# EasyEDA schematic SCH_ch559_2022-01-07.json
TITLE: CH559L 最小系统板; REV: 1.0; Date: 2021-06-14; Sheet: 1/1; Drawn By: DT9025A; Company: DT9025A
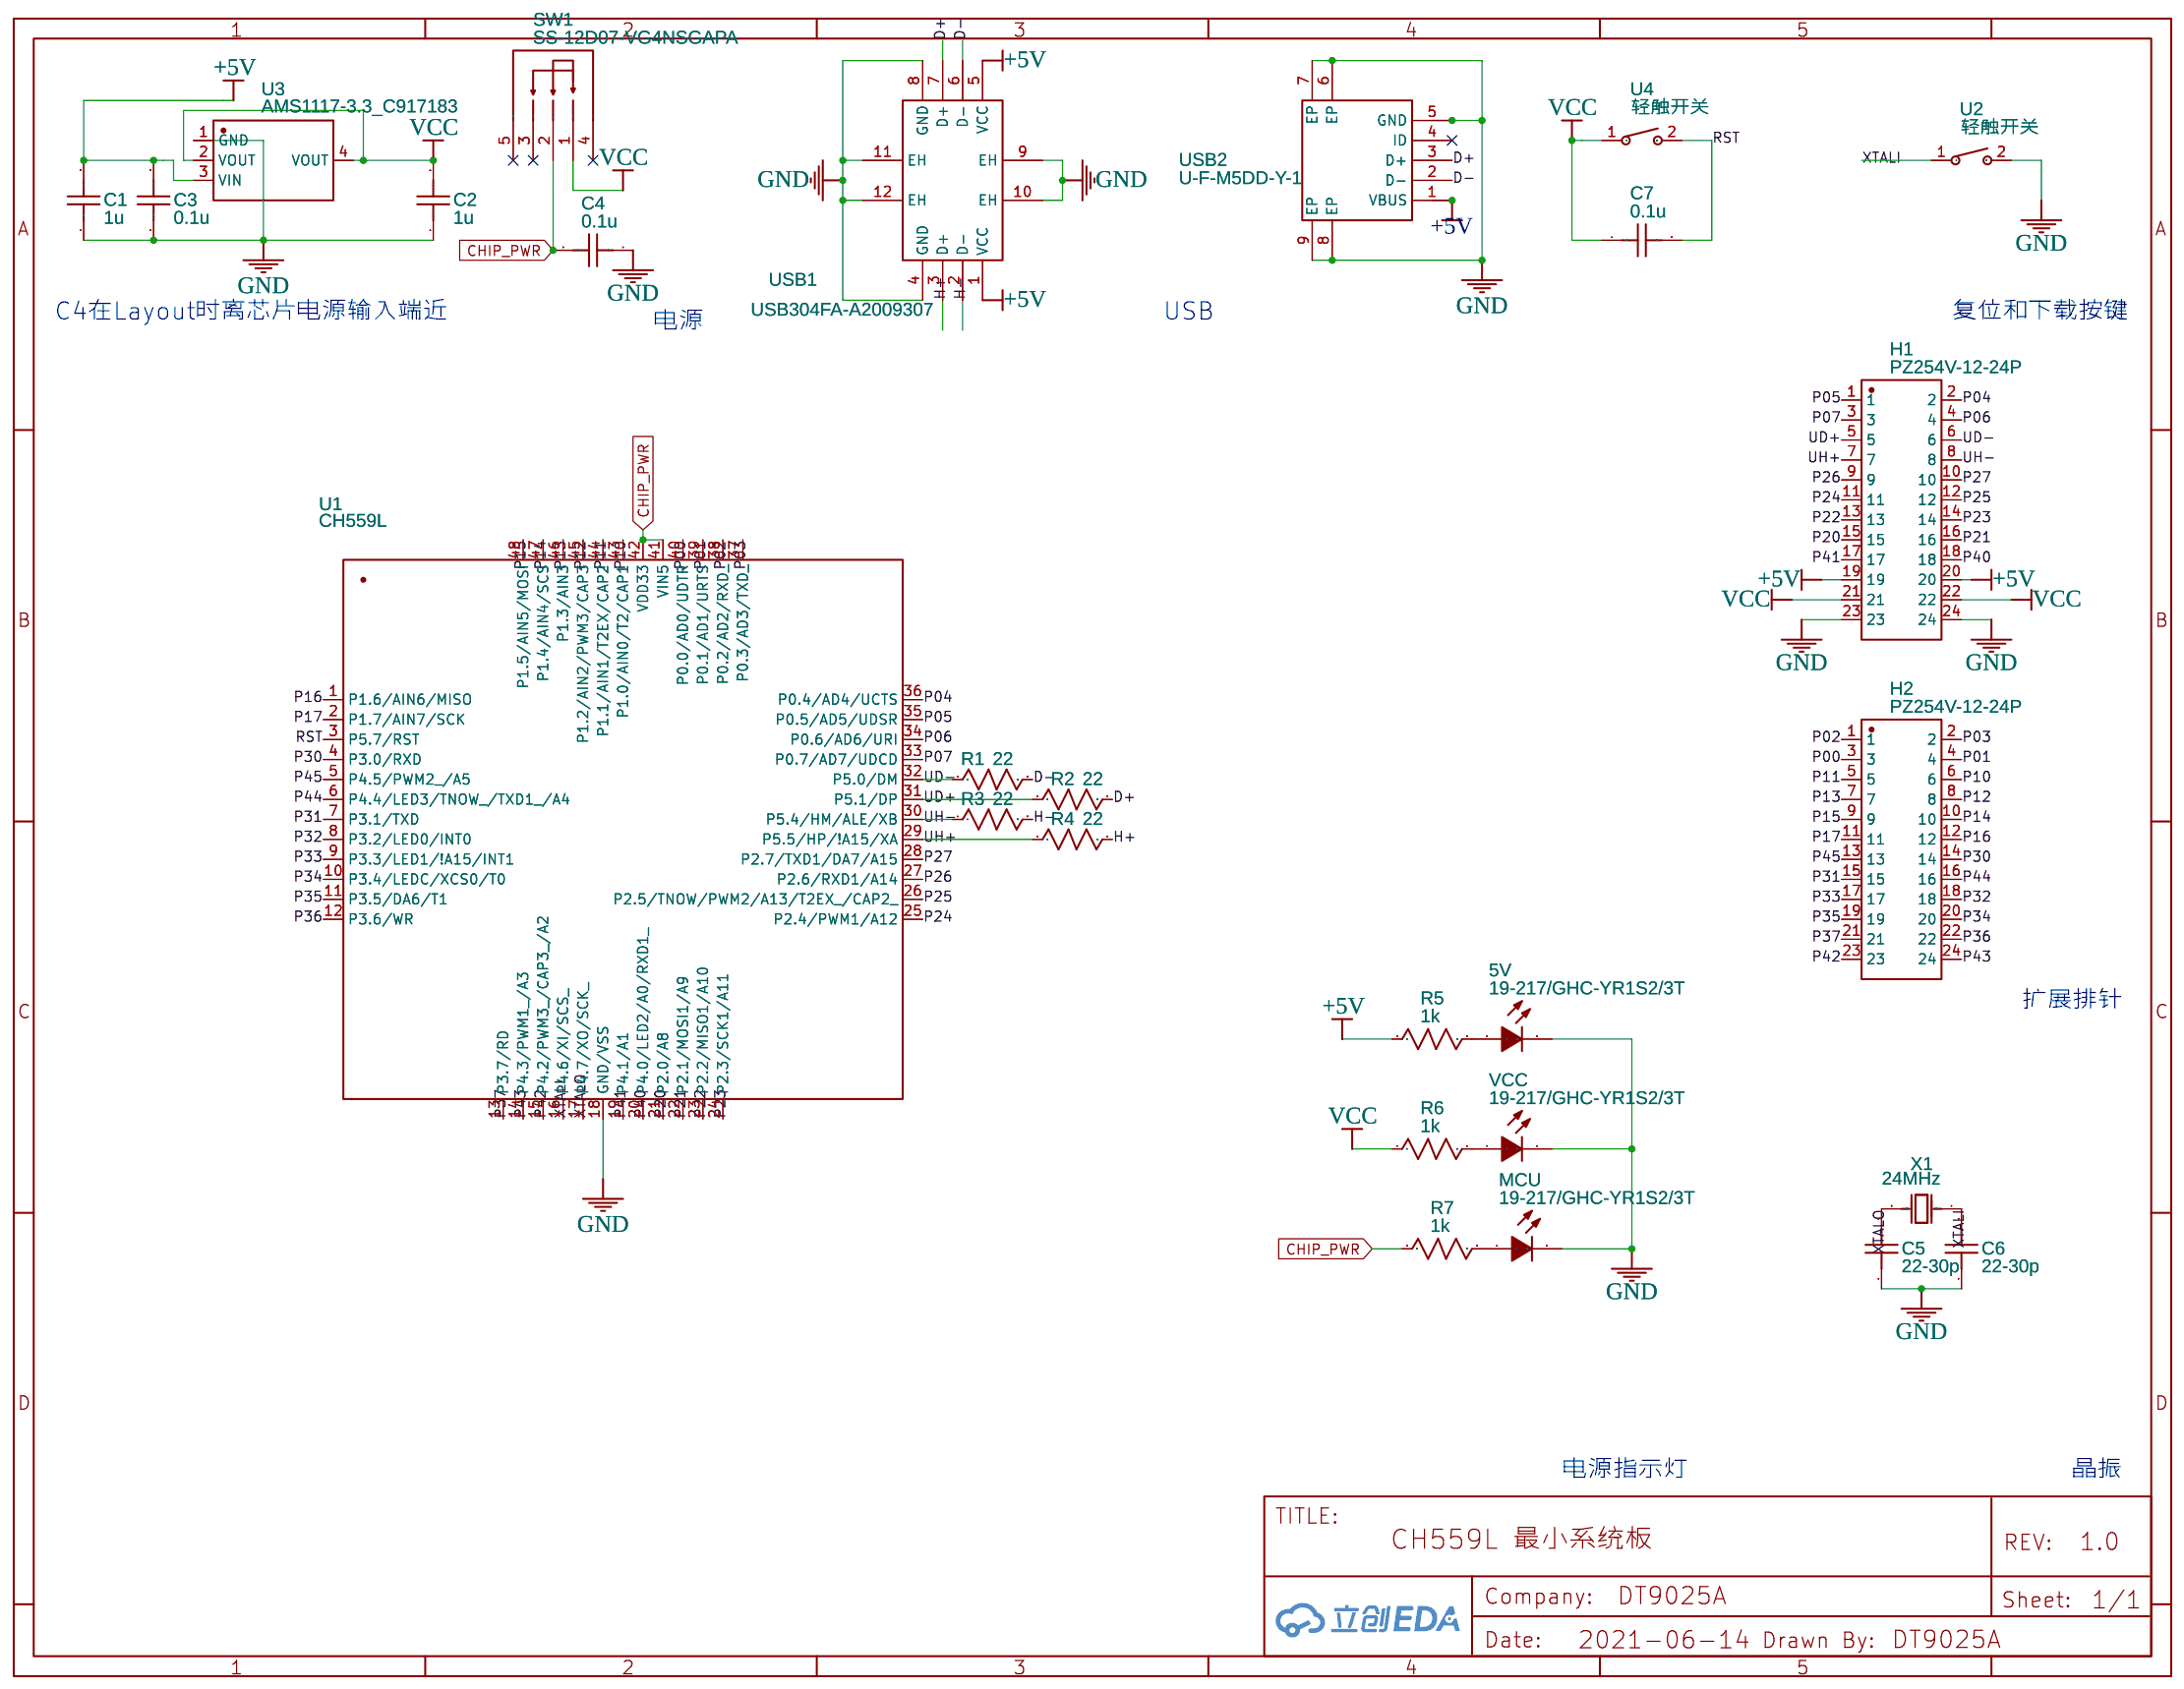
[diagram p0: schematic sheet]

## Parts
5V  19-217/GHC-YR1S2/3T  [LED0603-R-RD]
C1  1u  [C0603]
C2  1u  [C0603]
C3  0.1u  [C0603]
C4  0.1u  [C0603]
C5  22-30p  [C0603]
C6  22-30p  [C0603]
C7  0.1u  [C0603]
H1  PZ254V-12-24P  [HDR-TH_24P-P2.54-V-M-R2-C12-S2.54]
H2  PZ254V-12-24P  [HDR-TH_24P-P2.54-V-M-R2-C12-S2.54]
MCU  19-217/GHC-YR1S2/3T  [LED0603-R-RD]
R1  22  [R0603]
R2  22  [R0603]
R3  22  [R0603]
R4  22  [R0603]
R5  1k  [R0603]
R6  1k  [R0603]
R7  1k  [R0603]
SW1  SS-12D07-VG4NSGAPA  [SW-TH_SS-12D07-VG4NSGAPA]
U1  CH559L  [LQFP-48_7X7X05P]
U2  轻触开关  [SW-SMD_L6.0-W3.6-LS7.8]
U3  AMS1117-3.3_C917183  [SOT-223-3_L6.7-W3.7-P2.30-LS7.0-BR]
U4  轻触开关  [SW-SMD_L6.0-W3.6-LS7.8]
USB1  USB304FA-A2009307  [USB-A-TH_USB304FA-A2009307]
USB2  U-F-M5DD-Y-1  [MICRO-USB-SMD_U-F-M5DD-Y-1]
VCC  19-217/GHC-YR1S2/3T  [LED0603-R-RD]
X1  24MHz  [HC-49US_L11.5-W4.5-P4.88]

## Library data of the parts
5V MCU VCC = 19-217/GHC-YR1S2/3T: Supplier: LCSC; Manufacturer: EVERLIGHT; Supplier Part: C72043; JLCPCB Part Class: Basic Part
C1 C2 = C_0603_US: Contributor: LCEDA_Lib
C3-C7 = C_0805_US: Contributor: LCEDA_Lib
H1 H2 = PZ254V-12-24P: Supplier: LCSC; Supplier Part: C492429; Manufacturer: XFCN; Contributor: LCSC; JLCPCB Part Class: Extended Part
R1-R7 = R_0603_US: Contributor: LCEDA_Lib
SW1 = SS-12D07-VG4NSGAPA: Supplier: LCSC; Supplier Part: C221975; Manufacturer: C&K; Contributor: LCSC; JLCPCB Part Class: Extended Part
U1 = CH559L: Supplier: LCSC; Supplier Part: C150548; Manufacturer: Jiangsu Qin Heng; Contributor: liangcha; LCSC Assembly: Yes; SMT Type: Extend
U2 U4 = 轻触开关: Supplier: LCSC; Supplier Part: C9900000012; Manufacturer: null; JLCPCB Part Class: Extended Part; Contributor: LCSC
U3 = AMS1117-3.3_C917183: Supplier: LCSC; Supplier Part: C917183; Manufacturer: JSMSEMI; Manufacturer Part: AMS1117-3.3; Contributor: LCSC; JLCPCB Part Class: Extended Part
USB1 = USB304FA-A2009307: Supplier: LCSC; Supplier Part: C479985; Manufacturer: ATOM(爱特姆); Contributor: LCSC
USB2 = U-F-M5DD-Y-1: Supplier: LCSC; Manufacturer: HRO; Supplier Part: C91467; JLCPCB Part Class: Extended Part
X1 = X49SD24MSD2SC: Supplier: LCSC; Manufacturer: YXC; Supplier Part: C2213; JLCPCB Part Class: Extended Part

## Nets
+5V: C1.2 C3.2 H1.19 H1.20 R5.1 U3.3(VIN) USB1.1(VCC) USB1.5(VCC) USB2.1(VBUS)
GND: 5V.2(C) C1.1 C2.1 C3.1 C4.1 C5.1 C6.1 H1.23 H1.24 MCU.2(C) U1.18(GND/VSS) U2.2 U3.1(GND) USB1.4(GND) USB1.8(GND) USB1.9(EH) USB1.10(EH) USB1.11(EH) USB1.12(EH) USB2.5(GND) USB2.6(EP) USB2.7(EP) USB2.8(EP) USB2.9(EP) VCC.2(C)
VCC: C2.2 C7.1 H1.21 H1.22 R6.1 SW1.1 U3.2(VOUT) U3.4(VOUT) U4.1
CHIP_PWR: C4.2 R7.1 SW1.2 U1.41(VIN5) U1.42(VDD33)
D+: R2.2 USB1.7(D+) USB2.3(D+)
D-: R1.2 USB1.6(D-) USB2.2(D-)
H+: R4.2 USB1.3(D+)
H-: R3.2 USB1.2(D-)
P00: H2.3 U1.40(P0.0/AD0/UDTR)
P01: H2.4 U1.39(P0.1/AD1/URTS)
P02: H2.1 U1.38(P0.2/AD2/RXD_)
P03: H2.2 U1.37(P0.3/AD3/TXD_)
P04: H1.2 U1.36(P0.4/AD4/UCTS)
P05: H1.1 U1.35(P0.5/AD5/UDSR)
P06: H1.4 U1.34(P0.6/AD6/URI)
P07: H1.3 U1.33(P0.7/AD7/UDCD)
P10: H2.6 U1.43(P1.0/AIN0/T2/CAP1)
P11: H2.5 U1.44(P1.1/AIN1/T2EX/CAP2)
P12: H2.8 U1.45(P1.2/AIN2/PWM3/CAP3)
P13: H2.7 U1.46(P1.3/AIN3)
P14: H2.10 U1.47(P1.4/AIN4/SCS)
P15: H2.9 U1.48(P1.5/AIN5/MOSI)
P16: H2.12 U1.1(P1.6/AIN6/MISO)
P17: H2.11 U1.2(P1.7/AIN7/SCK)
P20: H1.15 U1.21(P2.0/A8)
P21: H1.16 U1.22(P2.1/MOSI1/A9)
P22: H1.13 U1.23(P2.2/MISO1/A10)
P23: H1.14 U1.24(P2.3/SCK1/A11)
P24: H1.11 U1.25(P2.4/PWM1/A12)
P25: H1.12 U1.26(P2.5/TNOW/PWM2/A13/T2EX_/CAP2_)
P26: H1.9 U1.27(P2.6/RXD1/A14)
P27: H1.10 U1.28(P2.7/TXD1/DA7/A15)
P30: H2.14 U1.4(P3.0/RXD)
P31: H2.15 U1.7(P3.1/TXD)
P32: H2.18 U1.8(P3.2/LED0/INT0)
P33: H2.17 U1.9(P3.3/LED1/!A15/INT1)
P34: H2.20 U1.10(P3.4/LEDC/XCS0/T0)
P35: H2.19 U1.11(P3.5/DA6/T1)
P36: H2.22 U1.12(P3.6/WR)
P37: H2.21 U1.13(P3.7/RD)
P40: H1.18 U1.20(P4.0/LED2/A0/RXD1_)
P41: H1.17 U1.19(P4.1/A1)
P42: H2.23 U1.15(P4.2/PWM3_/CAP3_/A2)
P43: H2.24 U1.14(P4.3/PWM1_/A3)
P44: H2.16 U1.6(P4.4/LED3/TNOW_/TXD1_/A4)
P45: H2.13 U1.5(P4.5/PWM2_/A5)
RST: C7.2 U1.3(P5.7/RST) U4.2
UD+: H1.5 R2.1 U1.31(P5.1/DP)
UD-: H1.6 R1.1 U1.32(P5.0/DM)
UH+: H1.7 R4.1 U1.29(P5.5/HP/!A15/XA)
UH-: H1.8 R3.1 U1.30(P5.4/HM/ALE/XB)
XTALI: C6.2 U1.16(P4.6/XI/SCS_) U2.1 X1.1(OSC1)
XTALO: C5.2 U1.17(P4.7/XO/SCK_) X1.2(OSC2)
Net-(5V-1): 5V.1(A) R5.2
Net-(MCU-1): MCU.1(A) R7.2
Net-(R6-2): R6.2 VCC.1(A)

Not connected (* = marked no-connect by the designer): SW1 3* 4* 5*; USB2 4(ID)*

## Notes on the sheet
- C4在Layout时离芯片电源输入端近
- 电源
- USB
- 复位和下载按键
- 扩展排针
- 电源指示灯
- 晶振
